# EAGLE design cell (EAGLE 9.2.2)
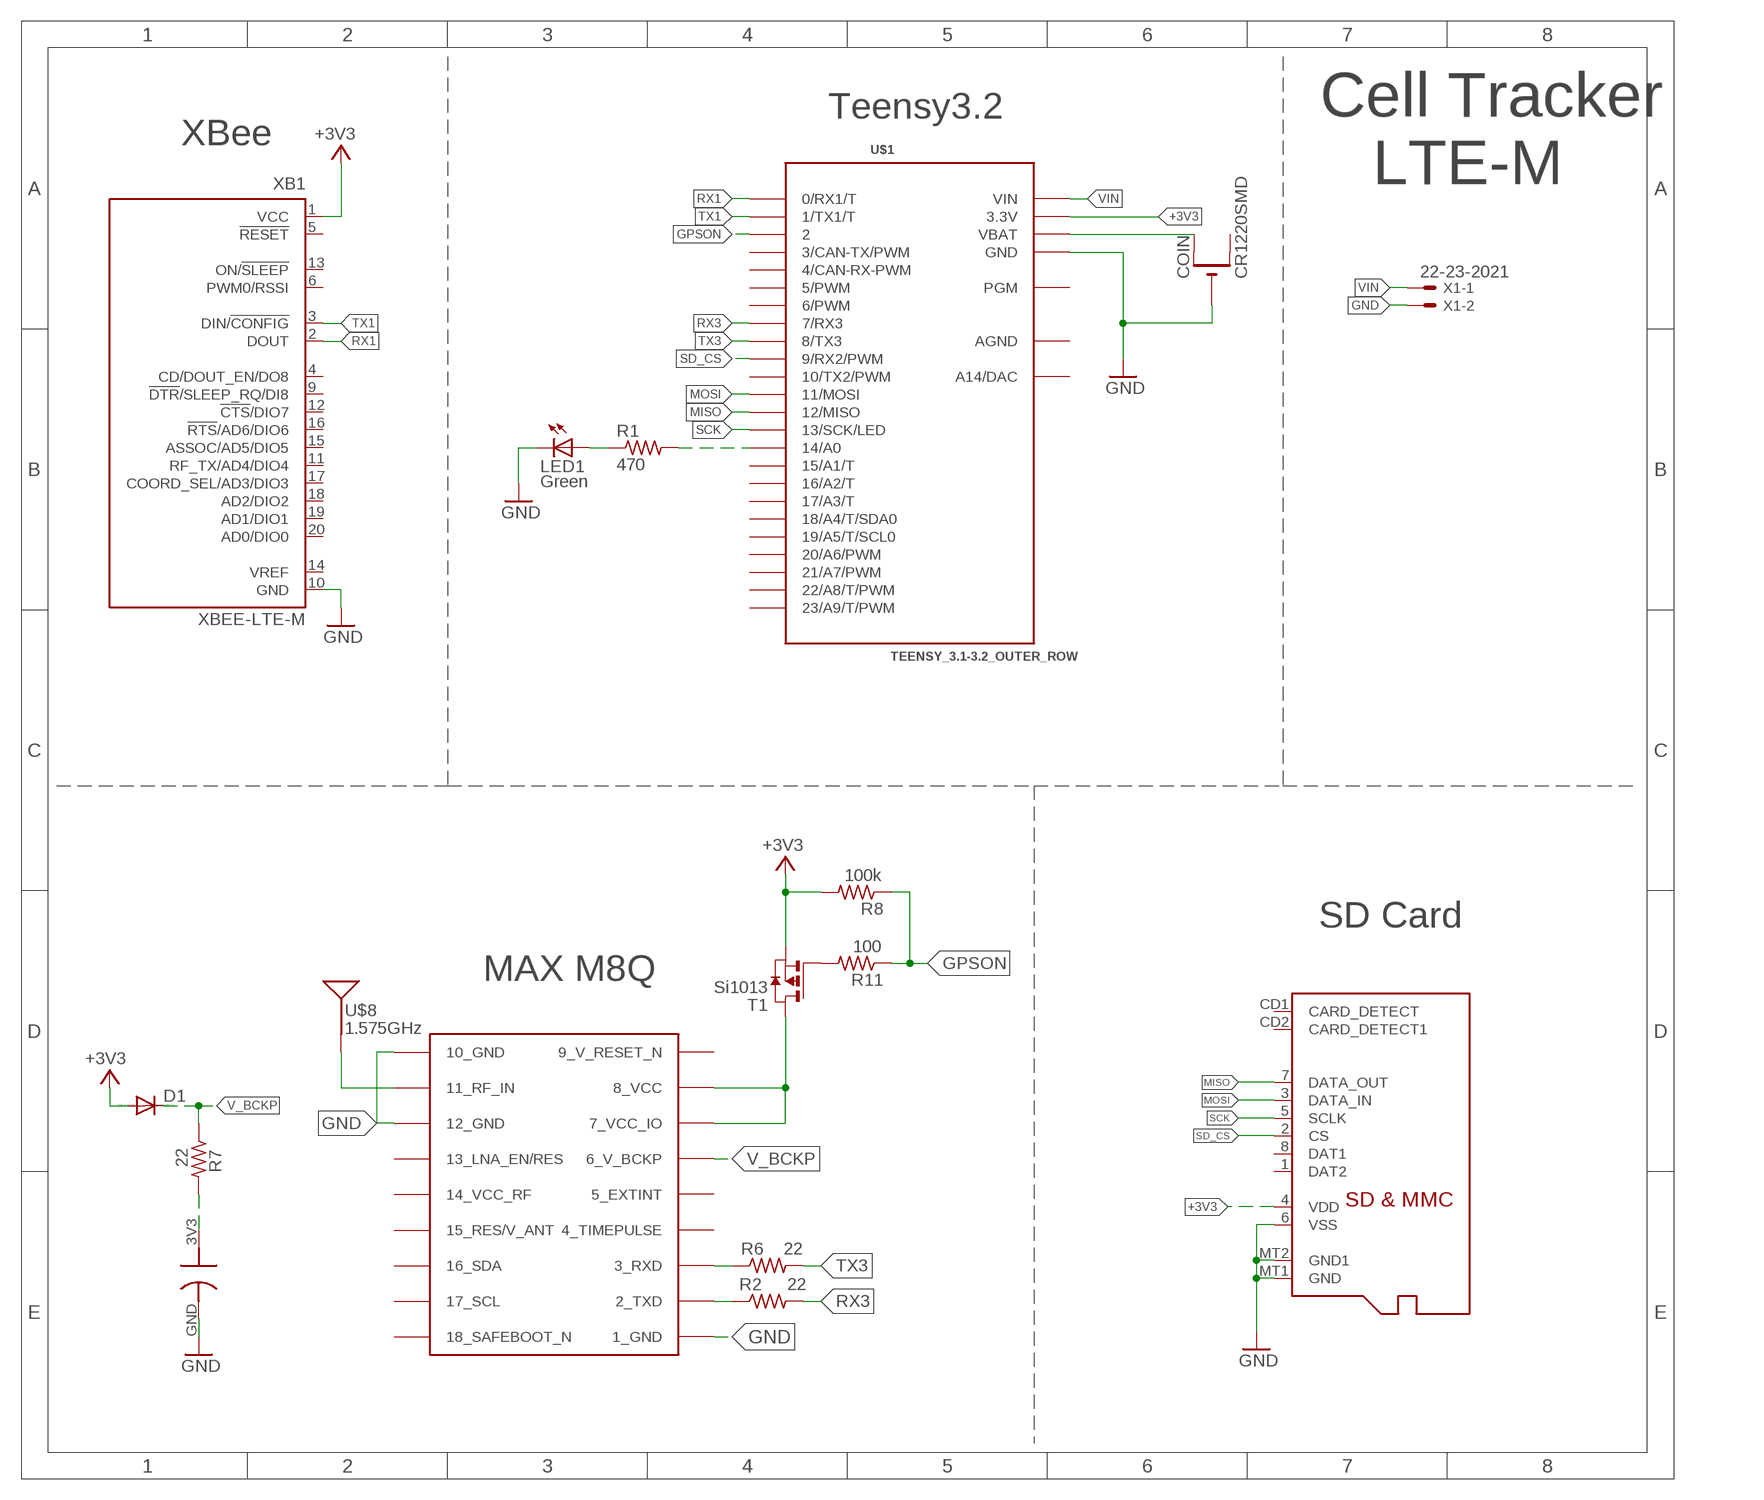
[diagram p0: schematic, sheet 1]

## Parts
C1  DCK-3R3E204T614-E  [ELNASUPERCAP]
COIN  CR1220SMD  CR1220SMT  [CR1220-SMD]
D1  DIODE-SOD523  [SOD523]
LED1  Green  LEDCHIP-LED0603  [CHIP-LED0603]
R1  470  R-US_R0603  [R0603]
R2  22  R-US_R0603  [R0603]
R6  22  R-US_R0603  [R0603]
R7  22  R-US_R0603  [R0603]
R8  100k  R-US_R0603  [R0603]
R11  100  R-US_R0603  [R0603]
T1  Si1013  PMOSSOT23  [SOT-23]
U$1  TEENSY_3.1-3.2_OUTER_ROW  [TEENSY_3.0-3.2&LC_OUTER_ROW]
U$2  MICROSD  [MICROSD]
U$7  MAX-M8  [MAX-M8]
U$8  1.575GHz  SPARKFUN-GPS_ANTENNAGPS-2X7MM  [SPARKFUN-GPS_ANT-GPS-2X7MM]
X1  22-23-2021  [22-23-2021]
XB1  XBEE-LTE-M  XBEE-PRO  [XBEE-PRO]

## Nets
+3V3: D1.A R8.2 T1.2(S) U$1.3.3V U$1.3.3V1(3.3V) U$2.4(VDD) XB1.1(VCC)
GND: C1.GND COIN.- LED1.C U$1.GND U$1.GND1(GND) U$2.6(VSS) U$2.MT1(GND) U$2.MT2(GND1) U$7.1_GND U$7.10_GND U$7.12_GND X1.2 XB1.10(GND)
GPSON: R8.1 R11.1 U$1.2
MISO: U$1.12(12/MISO) U$2.7(DATA_OUT)
MOSI: U$1.11(11/MOSI) U$2.3(DATA_IN)
N$1: U$7.11_RF_IN U$8.1(SIGNAL)
N$2: R1.2 U$1.14/A0
N$3: R6.1 U$7.3_RXD
N$4: R2.1 U$7.2_TXD
N$5: R11.2 T1.3(G)
N$10: LED1.A R1.1
N$11: T1.1(D) U$7.7_VCC_IO U$7.8_VCC
N$12: COIN.+$1(+) U$1.VBAT
N$13: C1.3V3 R7.2
RX1: U$1.0(0/RX1/T) XB1.2(DOUT)
RX3: R2.2 U$1.7(7/RX3)
SCK: U$1.13(13/SCK/LED) U$2.5(SCLK)
SD_CS: U$1.9(9/RX2/PWM) U$2.2(CS)
TX1: U$1.1(1/TX1/T) XB1.3(DIN/!CONFIG)
TX3: R6.2 U$1.8(8/TX3)
V_BCKP: D1.C R7.1 U$7.6_V_BCKP
VIN: U$1.VIN X1.1
Unconnected: COIN.+$2(+1) U$1.3(3/CAN-TX/PWM) U$1.4(4/CAN-RX-PWM) U$1.5(5/PWM) U$1.6(6/PWM) U$1.10(10/TX2/PWM) U$1.15/A1(15/A1/T) U$1.16/A2(16/A2/T) U$1.17/A3(17/A3/T) U$1.18/A4(18/A4/T/SDA0) U$1.19/A5(19/A5/T/SCL0) U$1.20/A6(20/A6/PWM) U$1.21/A7(21/A7/PWM) U$1.22/A8(22/A8/T/PWM) U$1.23/A9(23/A9/T/PWM) U$1.PGM U$1.RESET/DAC(A14/DAC) U$2.1(DAT2) U$2.8(DAT1) U$2.CD1(CARD_DETECT) U$2.CD2(CARD_DETECT1) U$7.4_TIMEPULSE U$7.5_EXTINT U$7.13_LNA_EN(13_LNA_EN/RES) U$7.14_VCC_RF U$7.15_V_ANT/RESERVED(15_RES/V_ANT) U$7.16_SDA U$7.17_SCL U$7.18_SAFEBOOT_N XB1.4(CD/DOUT_EN/DO8) XB1.5(!RESET) XB1.6(PWM0/RSSI) XB1.9(!DTR!/SLEEP_RQ/DI8) XB1.11(RF_TX/AD4/DIO4) XB1.12(!CTS!/DIO7) XB1.13(ON/!SLEEP) XB1.14(VREF) XB1.15(ASSOC/AD5/DIO5) XB1.16(!RTS!/AD6/DIO6) XB1.17(COORD_SEL/AD3/DIO3) XB1.18(AD2/DIO2) XB1.19(AD1/DIO1) XB1.20(AD0/DIO0)

## Notes on the sheet
- Teensy3.2
- XBee
- Cell Tracker
     LTE-M
- SD Card
- MAX M8Q

## Power pins joined to a net without a drawn wire
9_V_RESET_N: U$7.9_RESET_N(9_V_RESET_N)
AGND: U$1.AGND

## Library data of the parts
C1 = jmolterLib:DCK-3R3E204T614-E: ELNA Supercapacitor 3.3V max DCK-3R3E204T614-E 0.2F DCK-3R3E404T614-E 0.4F
COIN = adafruit:CR1220: CR1216/CR1220/CR1225 12mm 3V lithium coin cell Great for battery packup. Both SMT and THM holders. Note the THM package has the ground pads on both sides of the PCB so that the masks are the same - this reduces the cost
D1 = diode:DIODE-: DIODE
LED1 = led:LED: LED OSRAM: - CHIPLED LG R971, LG N971, LY N971, LG Q971, LY Q971, LO R971, LY R971 LH N974, LH R974 LS Q976, LO Q976, LY Q976 LO Q996 - Hyper CHIPLED LW Q18S LB Q993, LB Q99A, LB R99A - SideLED LS A670, LO A670, LY A670, LG A670, LP A670 LB A673, LV A673, LT A673, LW A673 LH A674 LY A675 LS A676, LA A676, LO A676, LY A676, LW A676 LS A679, LY A679, LG A679 - Hyper Micro SIDELED® LS Y876, LA Y876, LO Y876, LY Y876 LT Y87S - SmartLED LW L88C, LW L88S LB L89C, LB L89S, LG L890 LS L89K, LO L89K, LY L89K LS L896, LA L896, LO L896, LY L896 - TOPLED LS T670, LO T670, LY T670, LG T670, LP T670 LSG T670, LSP T670, LSY T670, LOP T670, LYG T670 LG T671, LOG T671, LSG T671 LB T673, LV T673, LT T673, LW T673 LH T674 LS T676, LA T676, LO T676, LY T676, LB T676, LH T676, LSB T676, LW T676 LB T67C, LV T67C, LT T67C, LS T67K, LO T67K, LY T67K, LW E67C LS E67B, LA E67B, LO E67B, LY E67B, LB E67C, LV E67C, LT E67C LW T67C LS T679, LY T679, LG T679 LS T770, LO T770, LY T770, LG T770, LP T770 LB T773, LV T773, LT T773, LW T773 LH T774 LS E675, LA E675, LY E675, LS T675 LS T776, LA T776, LO T776, LY T776, LB T776 LHGB T686 LT T68C, LB T68C - Hyper Mini TOPLED® LB M676 - Mini TOPLED Santana® LG M470 LS M47K, LO M47K, LY M47K Source: http://www.osram.convergy.de LUXEON: - LUMILED® LXK2-PW12-R00, LXK2-PW12-S00, LXK2-PW14-U00, LXK2-PW14-V00 LXK2-PM12-R00, LXK2-PM12-S00, LXK2-PM14-U00 LXK2-PE12-Q00, LXK2-PE12-R00, LXK2-PE12-S00, LXK2-PE14-T00, LXK2-PE14-U00 LXK2-PB12-K00, LXK2-PB12-L00, LXK2-PB12-M00, LXK2-PB14-N00, LXK2-PB14-P00, LXK2-PB14-Q00 LXK2-PR12-L00, LXK2-PR12-M00, LXK2-PR14-Q00, LXK2-PR14-R00 LXK2-PD12-Q00, LXK2-PD12-R00, LXK2-PD12-S00 LXK2-PH12-R00, LXK2-PH12-S00 LXK2-PL12-P00, LXK2-PL12-Q00, LXK2-PL12-R00 Source: www.luxeon.com KINGBRIGHT: KA-3528ASYC Source: www.kingbright.com
R1 = resistor:R-US_: RESISTOR, American symbol
R2 R6-R8 R11 = rcl:R-US_: RESISTOR, American symbol; SPICEPREFIX: R
T1 = zetex:PMOSSOT23: MOS FET; OC_FARNELL: unknown; OC_NEWARK: unknown
U$1 = Teensy_3_and_LC_Series_Boards_v1.4:TEENSY_3.1-3.2_OUTER_ROW: Footprint for Teensy 3.1 or 3.2 board using all pin connections on the outer perimeter
U$2 = adafruit:MICROSD: Micro-SD / Transflash card holder with SPI pinout For the 3M # 2908-05WB-MG and/or 4UCON #19656 push-push type
U$7 = ubloxLib:MAX-M8: u-blox MAX GNSS module
U$8 = Tracksoar v2 :SPARKFUN-GPS_ANTENNA: Single-ended Antennae 1.575GHz antennae with just one terminal. These are all chip antennae. 1575MHz (GPS) Antennae ANT-GPS-2X7MM - 2.0 x 7.0 mm chip antenna. (SparkFun Product <https://www.sparkfun.com/products/9131>) ANT-GPS-2X8MM - 2.0 x 8.0 mm chip antenna. (SparkFun Product <https://www.sparkfun.com/products/8418>); PROD_ID: ANT-09087; SF_ID: GPS-09131
X1 = con-molex:22-23-2021: .100" (2.54mm) Center Header - 2 Pin; MF: MOLEX; MPN: 22-23-2021; OC_FARNELL: 1462926; OC_NEWARK: 25C3832
XB1 = maxstream:XBEE: XBee (TM) /XBee-PRO(TM) OEM RF Modules Source: MaxStream, Inc. xbee_productmanual.pdf; MPN: XBP24-AWI-001; OC_FARNELL: 1337916; OC_NEWARK: 42M2667

## Board
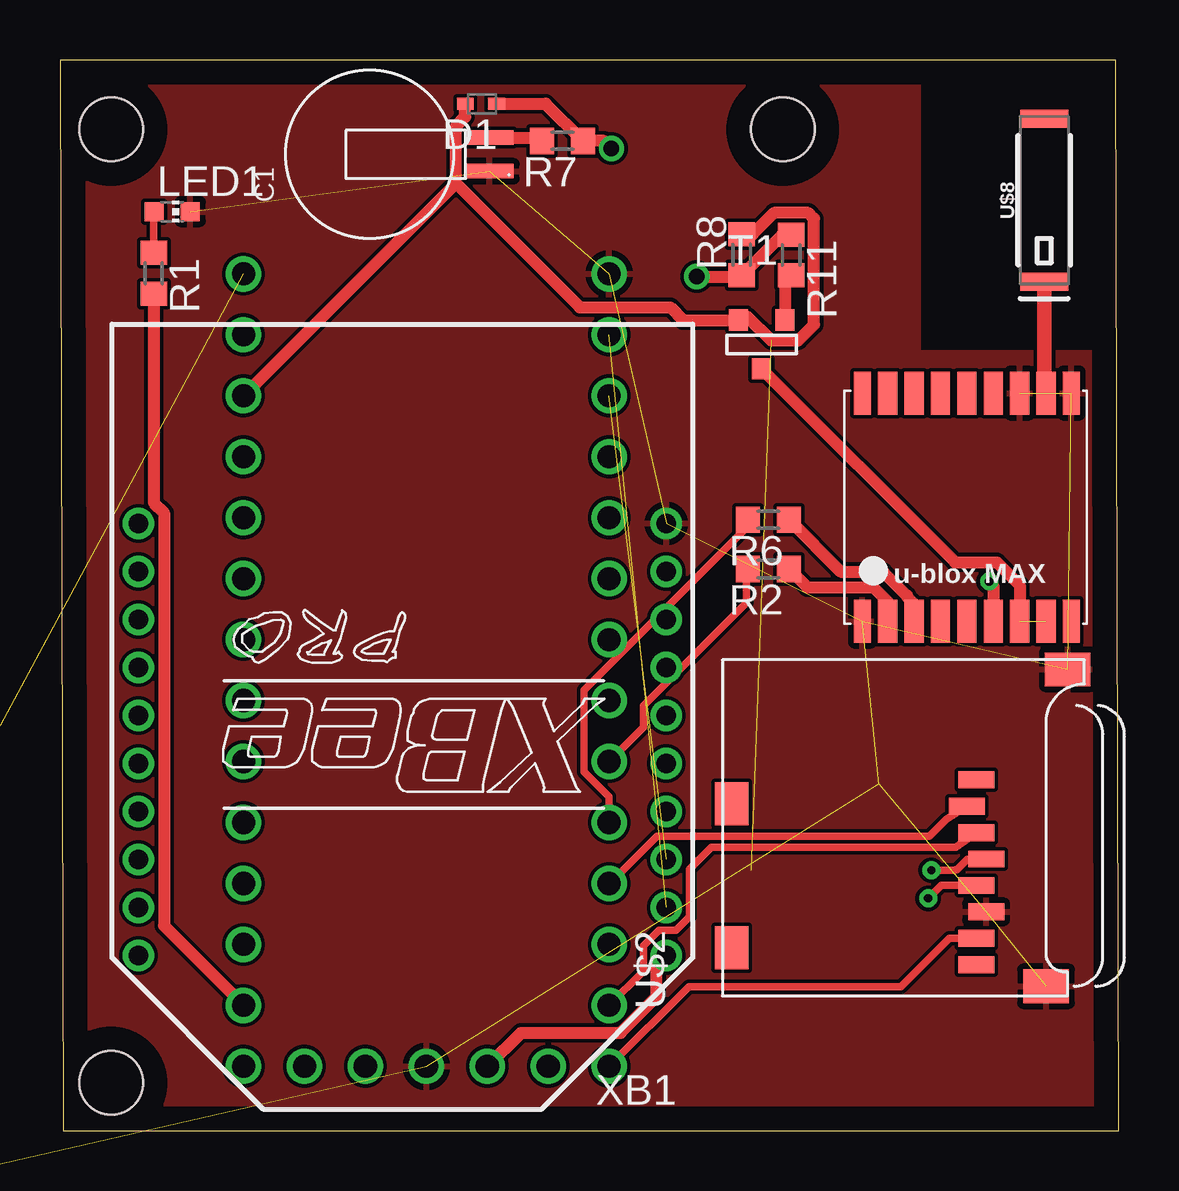
[diagram p1: board, top side]
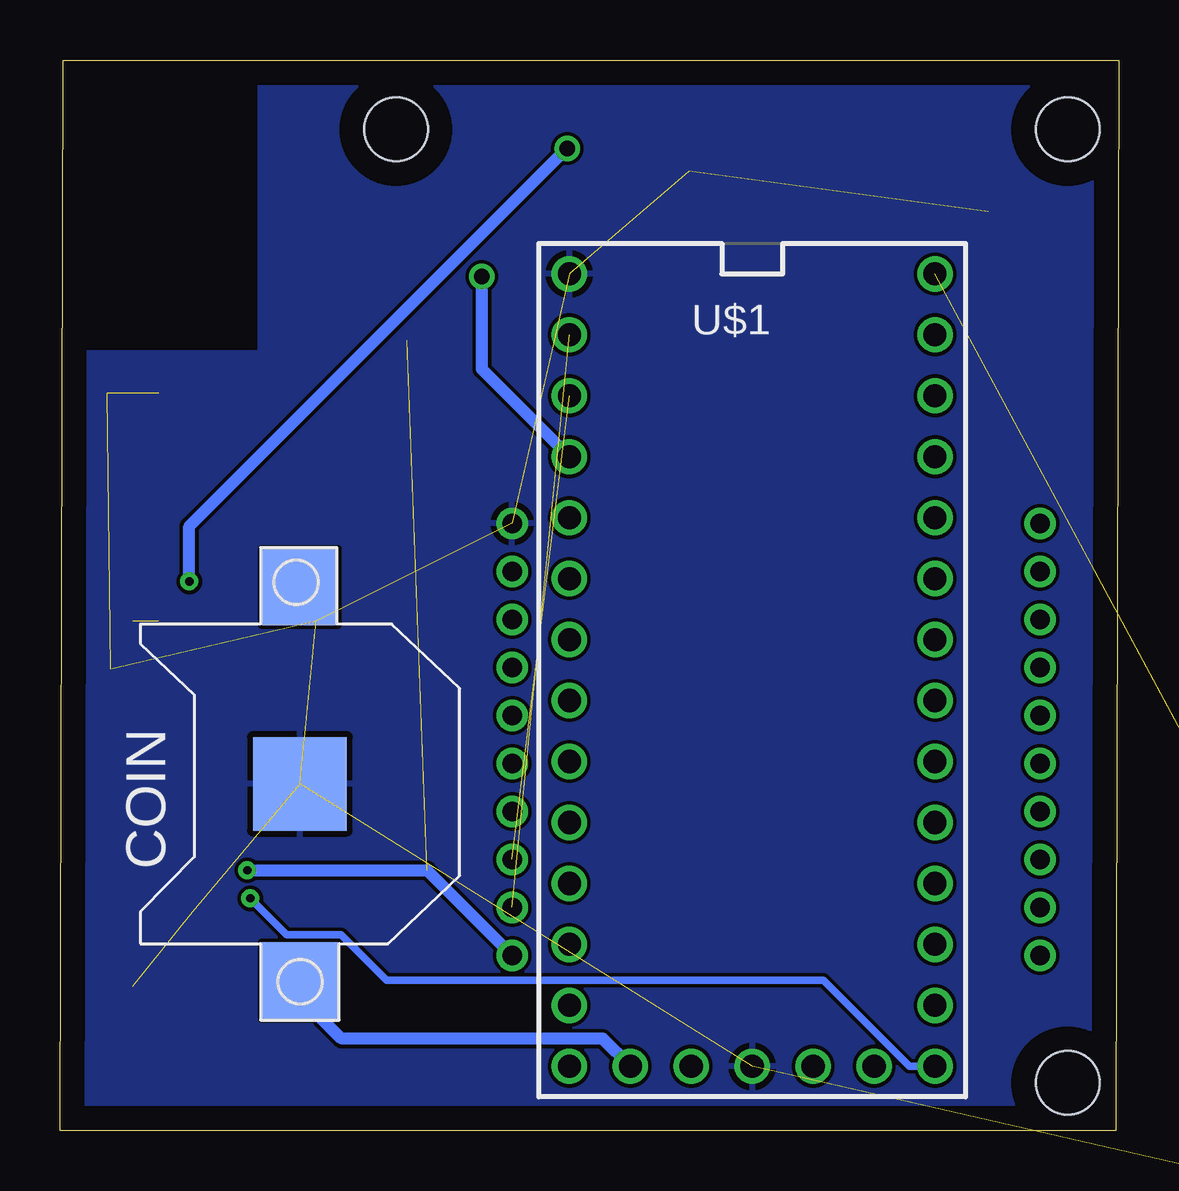
[diagram p2: board, bottom side, seen from below]

Size 44.13 x 44.62 mm. Coordinates in mm from the lower left corner, seen from the top.
Outline: 0.13,0 44.13,0 44,44.62 0,44.62 0.13,0
Copper layers (1*16): Top 0.035mm / dielectric 1.5mm / Bottom 0.035mm
Design rules "default": minimum track width 6mil, minimum drill 0.35mm, track to track 6mil, track to pad 6mil, pad to pad 6mil, via to via 6mil, smd to smd 6mil, copper to edge 40mil, drill to drill 6mil, minimum pad ring 10mil, minimum via ring 8mil, stop-mask expansion 4mil, vias tented up to drill 0mil, thermal gap 10mil
Holes 2.65 mm at 2.13,2 2.13,41.73 30.13,41.73

### Footprints (pad centres in the part's own frame; a part is rotated, then mirrored left to right if it is on the bottom)
ELNASUPERCAP = smd 0.6 x 2: 3V3 0.7,-1.5; GND -0.7,-1.5
CR1220-SMD = smd 3.2 x 3.2: +$1 -8.2,0; +$2 8.2,0 | smd 3.9 x 3.9: - 0,0
SOD523 = smd 0.7 x 0.5: A 0.7,0; C -0.6,0
CHIP-LED0603 = smd 0.8 x 0.8: A 0,-0.75; C 0,0.75
R0603 = smd 1 x 1.1: 1 -0.85,0; 2 0.85,0
SOT-23 = smd 0.787 x 0.889: 1 0.025,-1.016; 2 -0.94,1.016; 3 0.991,1.016
TEENSY_3.0-3.2&LC_OUTER_ROW = drill 0.965: 0 -7.62,13.97; 1 -7.62,11.43; 2 -7.62,8.89; 3 -7.62,6.35; 3.3V 7.62,11.43; 3.3V1 -2.54,-16.51; 4 -7.62,3.81; 5 -7.62,1.27; 6 -7.62,-1.27; 7 -7.62,-3.81; 8 -7.62,-6.35; 9 -7.62,-8.89; 10 -7.62,-11.43; 11 -7.62,-13.97; 12 -7.62,-16.51; 13 7.62,-16.51; 14/A0 7.62,-13.97; 15/A1 7.62,-11.43; 16/A2 7.62,-8.89; 17/A3 7.62,-6.35; 18/A4 7.62,-3.81; 19/A5 7.62,-1.27; 20/A6 7.62,1.27; 21/A7 7.62,3.81; 22/A8 7.62,6.35; 23/A9 7.62,8.89; AGND 7.62,13.97; GND -7.62,16.51; GND1 0,-16.51; PGM 2.54,-16.51; RESET/DAC 5.08,-16.51; VBAT -5.08,-16.51; VIN 7.62,16.51
MICROSD = smd 0.7 x 1.5: 1 9,-10.64; 2 7.9,-10.24; 3 6.8,-10.64; 4 5.7,-11.04; 5 4.6,-10.64; 6 3.5,-11.04; 7 2.4,-10.64; 8 1.3,-10.64 | smd 1.8 x 1.4: CD1 2,-0.44; CD2 8,-0.44 | smd 1.4 x 1.9: MT1 0.4,-13.54; MT2 13.6,-14.44
MAX-M8 = smd 1.8 x 0.7: 1_GND 4.95,-4.4; 9_RESET_N 4.95,4.3; 10_GND -4.55,4.3; 18_SAFEBOOT_N -4.55,-4.4 | smd 1.8 x 0.8: 2_TXD 4.95,-3.35; 3_RXD 4.95,-2.25; 4_TIMEPULSE 4.95,-1.15; 5_EXTINT 4.95,-0.05; 6_V_BCKP 4.95,1.05; 7_VCC_IO 4.95,2.15; 8_VCC 4.95,3.25; 11_RF_IN -4.55,3.25; 12_GND -4.55,2.15; 13_LNA_EN -4.55,1.05; 14_VCC_RF -4.55,-0.05; 15_V_ANT/RESERVED -4.55,-1.15; 16_SDA -4.55,-2.25; 17_SCL -4.55,-3.35
SPARKFUN-GPS_ANT-GPS-2X7MM = smd 0.75 x 2: 1 -3.4,0; NC 3.4,0
22-23-2021 = drill 1 long: 1 -1.27,0; 2 1.27,0
XBEE-PRO = drill 0.8 pad 1.27: 1 -11,9; 2 -11,7; 3 -11,5; 4 -11,3; 5 -11,1; 6 -11,-1; 7 -11,-3; 8 -11,-5; 9 -11,-7; 10 -11,-9; 11 11,-9; 12 11,-7; 13 11,-5; 14 11,-3; 15 11,-1; 16 11,1; 17 11,3; 18 11,5; 19 11,7; 20 11,9

### Placement (x,y rotation side)
C1  16.41,40.69 90 top
COIN  34.12,14.46 90 bottom
D1  17.59,42.8 180 top
LED1  4.67,38.3 270 top
R1  3.91,35.73 270 top
R2  29.53,23.41 180 top
R6  29.53,25.46 180 top
R7  20.95,41.25 180 top
R8  28.42,36.51 90 top
R11  30.48,36.5 270 top
T1  29.22,32.77 0 top
U$1  15.27,19.2 0 bottom
U$2  27.57,5.63 90 top
U$7  37.85,26.19 270 top
U$8  41.03,38.78 90 top
X1  -12.06,-3.26 0 top  (outside the outline)
XB1  14.27,16.31 180 top

### Tracks (layer width: path | path; a pad name or v marks a point on that pad's centre or on a via)
+3V3  (via drill 0.35)  (1 unrouted)
  Top 0.305: v36.32,10.86 37.31,10.86 37.33,10.88 37.39,10.88 37.83,11.33 U$2.4
  Top 0.508: D1.A 16.89,42.25 16.51,41.86 16.51,39.48 | 16.51,39.48 21.68,34.31 25.45,34.31 25.97,33.78 T1.2 | T1.2 28.42,33.92 28.66,33.92 29.65,32.93 30.77,32.93 31.43,33.59 31.43,38.01 31.2,38.25 29.76,38.25 28.87,37.36 R8.2 | XB1.1 24.87,6.91 24.87,5.59 23.36,4.09 19.21,4.09 U$1.3.3V1 | U$1.3.3V 16.51,39.48 | 28.28,33.9 T1.2
  Bottom 0.508: XB1.1 28.83,10.87 36.31,10.87 v36.32,10.86
GND  (12 unrouted)
  pour Top: -1.87,46 -1.87,-2 45.13,-2 45.13,32.47 35.83,32.47 35.83,46
  pour Bottom: -1.87,46 -1.87,-2 45.13,-2 45.13,32.47 35.83,32.47 35.83,46
GPSON  (via drill 0.65)
  Top 0.508: R11.1 30.1,37.34 R8.1 28.36,35.6 v26.54,35.6
  Bottom 0.508: U$1.2 26.54,31.74 v26.54,35.6
MISO
  Top 0.305: U$2.7 37.07,8.03 35.05,6.01 26.21,6.01 U$1.12
MOSI
  Top 0.305: U$2.3 37.35,11.83 27.16,11.83 26.23,10.9 26.23,8.91 25.67,8.35 24.96,8.35 24.31,7.71 24.31,6.65 U$1.11
N$1
  Top 0.61: U$8.1 41.03,30.74 U$7.11_RF_IN
N$2
  Top 0.508: R1.2 3.91,26.17 4.33,25.75 4.33,8.55 U$1.14/A0
N$3
  Top 0.508: R6.1 32.54,23.3 34.31,23.3 35.31,22.31 35.31,22.26 35.69,21.88 35.69,21.32 U$7.3_RXD
N$4
  Top 0.508: R2.1 31.15,22.64 33.91,22.64 34.5,22.05 U$7.2_TXD
N$5
  Top 0.508: R11.2 30.21,35.38 T1.3
N$10
  Top 0.305: R1.1 3.91,38.29 LED1.A
N$11  (1 unrouted)
  Top 0.508: T1.1 37.32,23.68 39.06,23.68 40,22.74 U$7.7_VCC_IO
N$12
  Bottom 0.508: U$1.VBAT 21.51,3.85 32.39,3.85 34.12,5.59 COIN.+$1
N$13
  Top 0.508: C1.3V3 19.96,41.39 R7.2
RX1  (1 unrouted)
RX3
  Top 0.305: R2.2 28.61,23.34 28.61,22 24.31,17.71 24.31,16.81 U$1.7
SCK  (via drill 0.35)
  Top 0.305: v36.2,9.69 36.73,10.23 U$2.5
  Bottom 0.305: v36.2,9.69 34.67,8.16 32.4,8.16 30.5,6.27 12.3,6.27 8.72,2.69 U$1.13
SD_CS
  Top 0.305: U$1.9 22.92,10.31 24.89,12.28 36.25,12.28 36.96,12.99 U$2.2
TX1  (1 unrouted)
TX3
  Top 0.305: U$1.8 22.89,13.92 21.85,14.96 21.85,18.36 28.65,25.16 28.65,25.43 R6.2
V_BCKP  (via drill 0.35, 0.65)
  Top 0.305: D1.C 18.29,42.7
  Top 0.508: D1.C 20.25,42.8 R7.1 22.67,41.25 v22.99,40.93 | v38.73,22.9 38.9,22.73 U$7.6_V_BCKP
  Bottom 0.508: v38.73,22.9 38.73,25.18 v22.99,40.93
VIN  (1 unrouted)